# EAGLE design board (EAGLE 8.7.1)
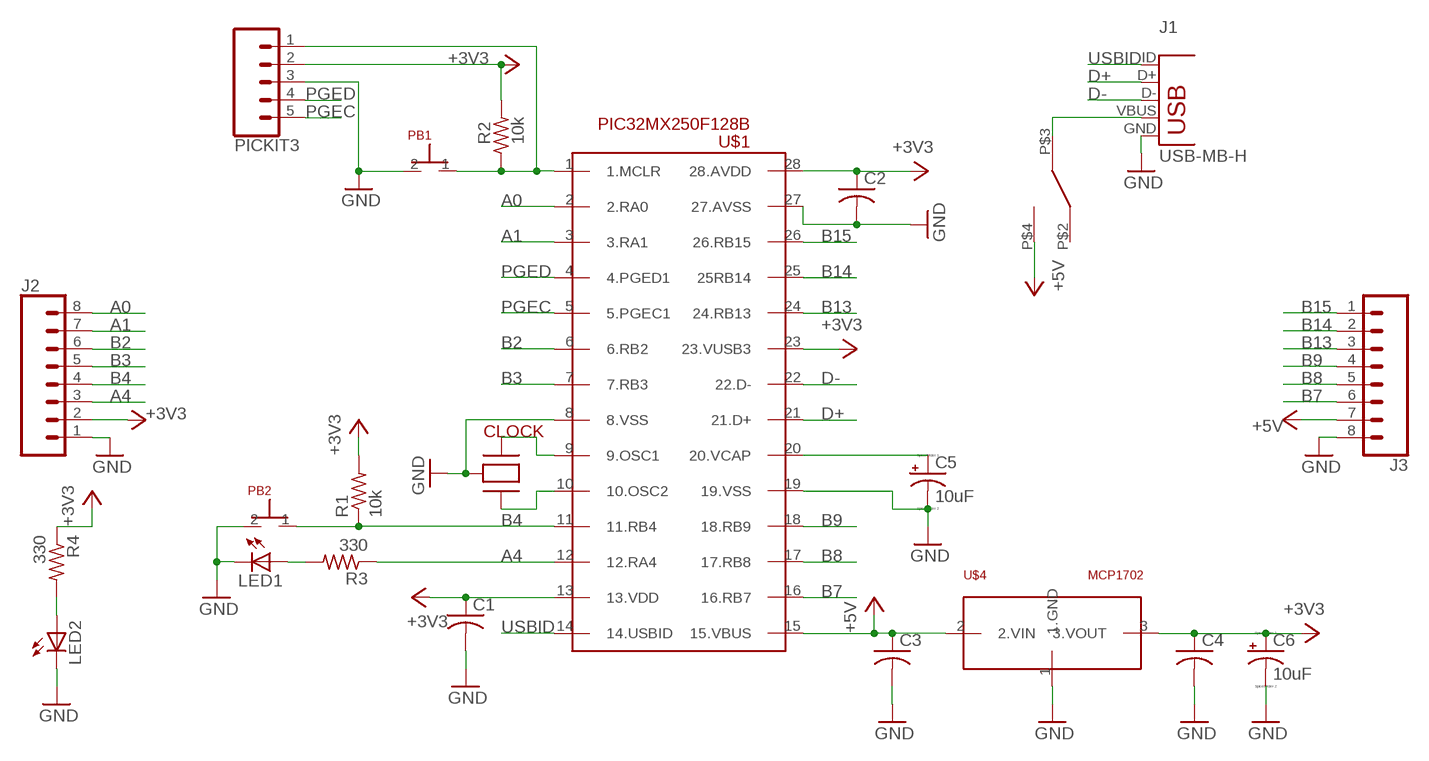
[diagram p0: schematic, sheet 1]

## Parts
C1  C-US025-024X044  [C025-024X044]
C2  C-US025-024X044  [C025-024X044]
C3  C-US025-024X044  [C025-024X044]
C4  C-US025-024X044  [C025-024X044]
C5  10uF  CPOL-USB45181A  [B45181A]
C6  10uF  CPOL-USB45181A  [B45181A]
CLOCK  CLOCK  [CLOCK]
J1  USB-MB-H  [USB-MB-H]
J2  CONN_08"  [1X08]
J3  CONN_08"  [1X08]
LED1  LED3MM  [LED3MM]
LED2  LED3MM  [LED3MM]
PB1  PBUTTON  [PBUTTON]
PB2  PBUTTON  [PBUTTON]
PICKIT3  CONN_05  [1X05]
R1  10k  R-US_0204/7  [0204/7]
R2  10k  R-US_0204/7  [0204/7]
R3  330  R-US_0204/7  [0204/7]
R4  330  R-US_0204/7  [0204/7]
U$1  PIC32MX250F128B  [DIL28-3]
U$2  SWITCH  [SWITCH]
U$4  MCP1702  [TO92]

## Nets
+3V3: C1.1 C2.1 C4.1 C6.+ J2.2 PICKIT3.2 R1.2 R2.2 R4.1 U$1.13(13.VDD) U$1.23(23.VUSB3) U$1.28(28.AVDD) U$4.3(3.VOUT)
+5V: C3.1 J3.7 U$1.15(15.VBUS) U$2.P$4(4.OUT2) U$4.2(2.VIN)
A0: J2.8 U$1.2(2.RA0)
A1: J2.7 U$1.3(3.RA1)
A4: J2.3 R3.1 U$1.12(12.RA4)
B2: J2.6 U$1.6(6.RB2)
B3: J2.5 U$1.7(7.RB3)
B4: J2.4 PB2.1(PIN1) R1.1 U$1.11(11.RB4)
B7: J3.6 U$1.16(16.RB7)
B8: J3.5 U$1.17(17.RB8)
B9: J3.4 U$1.18(18.RB9)
B13: J3.3 U$1.24(24.RB13)
B14: J3.2 U$1.25(25RB14)
B15: J3.1 U$1.26(26.RB15)
D+: J1.D+ U$1.21(21.D+)
D-: J1.D- U$1.22(22.D-)
GND: C1.2 C2.2 C3.2 C4.2 C5.- C6.- CLOCK.2(2.GND) J1.GND J2.1 J3.8 LED1.K(C) LED2.K(C) PB1.2(PIN2) PB2.2(PIN2) PICKIT3.3 U$1.8(8.VSS) U$1.19(19.VSS) U$1.27(27.AVSS) U$4.1(1.GND)
N$1: PB1.1(PIN1) PICKIT3.1 R2.1 U$1.1(1.MCLR)
N$4: J1.VBUS U$2.P$3(3.IN)
N$9: C5.+ U$1.20(20.VCAP)
N$10: CLOCK.1(1.OSC1) U$1.9(9.OSC1)
N$11: CLOCK.3(3.OSC2) U$1.10(10.OSC2)
N$13: LED1.A R3.2
N$16: LED2.A R4.2
PGEC: PICKIT3.5 U$1.5(5.PGEC1)
PGED: PICKIT3.4 U$1.4(4.PGED1)
USBID: J1.ID U$1.14(14.USBID)
Unconnected: U$2.P$2(2.OUT1)

## Library data of the parts
C1-C4 = lib1:C-US: CAPACITOR, American symbol
C5 C6 = lib1:CPOL-US: POLARIZED CAPACITOR, American symbol
CLOCK = lib1:CLOCK
J1 = lib1:USB: USB Connectors USB-B-PTH is fully proven SKU : PRT-00139/CONN-08278 USB-miniB is fully proven SKU : PRT-00587 USB-A-PCB is untested. USB-A-H is throughly reviewed, but untested. Spark Fun Electronics SKU : PRT-00437 USB-B-SMT is throughly reviewed, but untested. Needs silkscreen touching up. USB-A-S has not been used/tested USB-MB-H has not been used/tested USB-MICROB has been used. CONN-09505
J2 J3 = lib1:CONN_08: Multi connection point. Often used as Generic Header-pin footprint for 0.1 inch spaced/style header connections On any of the 0.1 inch spaced packages, you can populate with these: Break Away Headers - Straight <https://www.sparkfun.com/products/116> (PRT-00116) Break Away Male Headers - Right Angle <https://www.sparkfun.com/products/553> (PRT-00553) Female Headers <https://www.sparkfun.com/products/115> (PRT-00115) Break Away Headers - Machine Pin <https://www.sparkfun.com/products/117> (PRT-00117) Break Away Female Headers - Swiss Machine Pin <https://www.sparkfun.com/products/743> (PRT-00743) Arduino Stackable Header - 8 Pin <https://www.sparkfun.com/products/9279> (PRT-09279) For SCREWTERMINALS and SPRING TERMINALS visit here: Screw Terimnals on SparkFun.com <https://www.sparkfun.com/search/results?term=Screw+Terminals> (5mm/3.5mm/2.54mm spacing) This device is also useful as a general connection point to wire up your design to another part of your project. Our various solder wires solder well into these plated through hole pads. Hook-Up Wire - Assortment (Stranded, 22 AWG) <https://www.sparkfun.com/products/11375> (PRT-11375) Hook-Up Wire - Assortment (Solid Core, 22 AWG) <https://www.sparkfun.com/products/11367> (PRT-11367) View the entire wire category on our website here <https://www.sparkfun.com/categories/141> Special notes: Molex polarized connector foot print use with SKU : PRT-08231 with associated crimp pins and housings. 1MM SMD Version SKU: PRT-10208 NOTES ON THE VARIANTS LOCK and LOCK_LONGPADS... This footprint was designed to help hold the alignment of a through-hole component (i.e. 6-pin header) while soldering it into place. You may notice that each hole has been shifted either up or down by 0.005 of an inch from it's more standard position (which is a perfectly straight line). This slight alteration caused the pins (the squares in the middle) to touch the edges of the holes. Because they are alternating, it causes a "brace" to hold the component in place. 0.005 has proven to be the perfect amount of "off-center" position when using our standard breakaway headers. Although looks a little odd when you look at the bare footprint, once you have a header in there, the alteration is very hard to notice. Also,if you push a header all the way into place, it is covered up entirely on the bottom side.; PROD_ID: CONN-08438
LED1 LED2 = lib1:LED: LED OSRAM: - CHIPLED LG R971, LG N971, LY N971, LG Q971, LY Q971, LO R971, LY R971 LH N974, LH R974 LS Q976, LO Q976, LY Q976 LO Q996 - Hyper CHIPLED LW Q18S LB Q993, LB Q99A, LB R99A - SideLED LS A670, LO A670, LY A670, LG A670, LP A670 LB A673, LV A673, LT A673, LW A673 LH A674 LY A675 LS A676, LA A676, LO A676, LY A676, LW A676 LS A679, LY A679, LG A679 - Hyper Micro SIDELED® LS Y876, LA Y876, LO Y876, LY Y876 LT Y87S - SmartLED LW L88C, LW L88S LB L89C, LB L89S, LG L890 LS L89K, LO L89K, LY L89K LS L896, LA L896, LO L896, LY L896 - TOPLED LS T670, LO T670, LY T670, LG T670, LP T670 LSG T670, LSP T670, LSY T670, LOP T670, LYG T670 LG T671, LOG T671, LSG T671 LB T673, LV T673, LT T673, LW T673 LH T674 LS T676, LA T676, LO T676, LY T676, LB T676, LH T676, LSB T676, LW T676 LB T67C, LV T67C, LT T67C, LS T67K, LO T67K, LY T67K, LW E67C LS E67B, LA E67B, LO E67B, LY E67B, LB E67C, LV E67C, LT E67C LW T67C LS T679, LY T679, LG T679 LS T770, LO T770, LY T770, LG T770, LP T770 LB T773, LV T773, LT T773, LW T773 LH T774 LS E675, LA E675, LY E675, LS T675 LS T776, LA T776, LO T776, LY T776, LB T776 LHGB T686 LT T68C, LB T68C - Hyper Mini TOPLED® LB M676 - Mini TOPLED Santana® LG M470 LS M47K, LO M47K, LY M47K Source: http://www.osram.convergy.de LUXEON: - LUMILED® LXK2-PW12-R00, LXK2-PW12-S00, LXK2-PW14-U00, LXK2-PW14-V00 LXK2-PM12-R00, LXK2-PM12-S00, LXK2-PM14-U00 LXK2-PE12-Q00, LXK2-PE12-R00, LXK2-PE12-S00, LXK2-PE14-T00, LXK2-PE14-U00 LXK2-PB12-K00, LXK2-PB12-L00, LXK2-PB12-M00, LXK2-PB14-N00, LXK2-PB14-P00, LXK2-PB14-Q00 LXK2-PR12-L00, LXK2-PR12-M00, LXK2-PR14-Q00, LXK2-PR14-R00 LXK2-PD12-Q00, LXK2-PD12-R00, LXK2-PD12-S00 LXK2-PH12-R00, LXK2-PH12-S00 LXK2-PL12-P00, LXK2-PL12-Q00, LXK2-PL12-R00 Source: www.luxeon.com KINGBRIGHT: KA-3528ASYC Source: www.kingbright.com
PB1 PB2 = lib1:PBUTTON
PICKIT3 = lib1:CONN_05: Multi connection point. Often used as Generic Header-pin footprint for 0.1 inch spaced/style header connections On any of the 0.1 inch spaced packages, you can populate with these: Break Away Headers - Straight <https://www.sparkfun.com/products/116> (PRT-00116) Break Away Male Headers - Right Angle <https://www.sparkfun.com/products/553> (PRT-00553) Female Headers <https://www.sparkfun.com/products/115> (PRT-00115) Break Away Headers - Machine Pin <https://www.sparkfun.com/products/117> (PRT-00117) Break Away Female Headers - Swiss Machine Pin <https://www.sparkfun.com/products/743> (PRT-00743) For SCREWTERMINALS and SPRING TERMINALS visit here: Screw Terimnals on SparkFun.com <https://www.sparkfun.com/search/results?term=Screw+Terminals> (5mm/3.5mm/2.54mm spacing) This device is also useful as a general connection point to wire up your design to another part of your project. Our various solder wires solder well into these plated through hole pads. Hook-Up Wire - Assortment (Stranded, 22 AWG) <https://www.sparkfun.com/products/11375> (PRT-11375) Hook-Up Wire - Assortment (Solid Core, 22 AWG) <https://www.sparkfun.com/products/11367> (PRT-11367) View the entire wire category on our website here <https://www.sparkfun.com/categories/141> Special notes: Molex polarized connector foot print use with SKU : PRT-08231 with associated crimp pins and housings. 1MM SMD Version SKU: PRT-10208
R1-R4 = lib1:R-US_: RESISTOR, American symbol
U$1 = lib1:PIC32MX250F128B
U$2 = lib1:SWITCH
U$4 = lib1:MCP1702

## Board
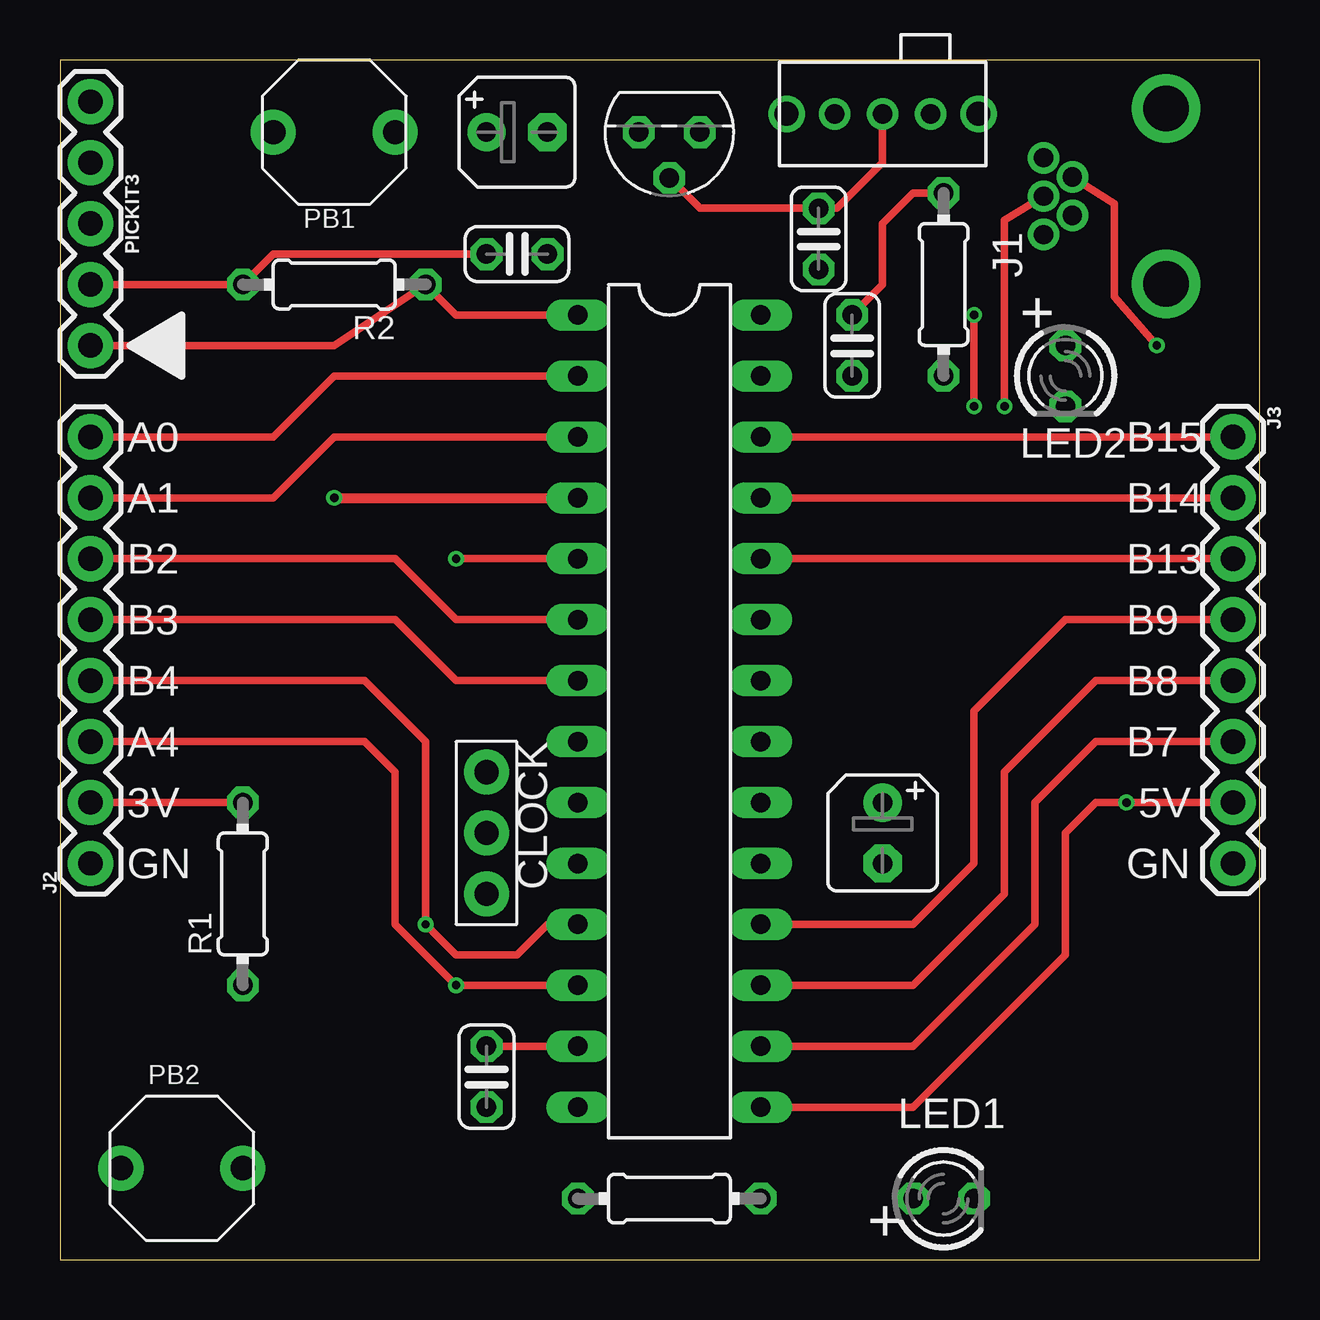
[diagram p1: board, top side]
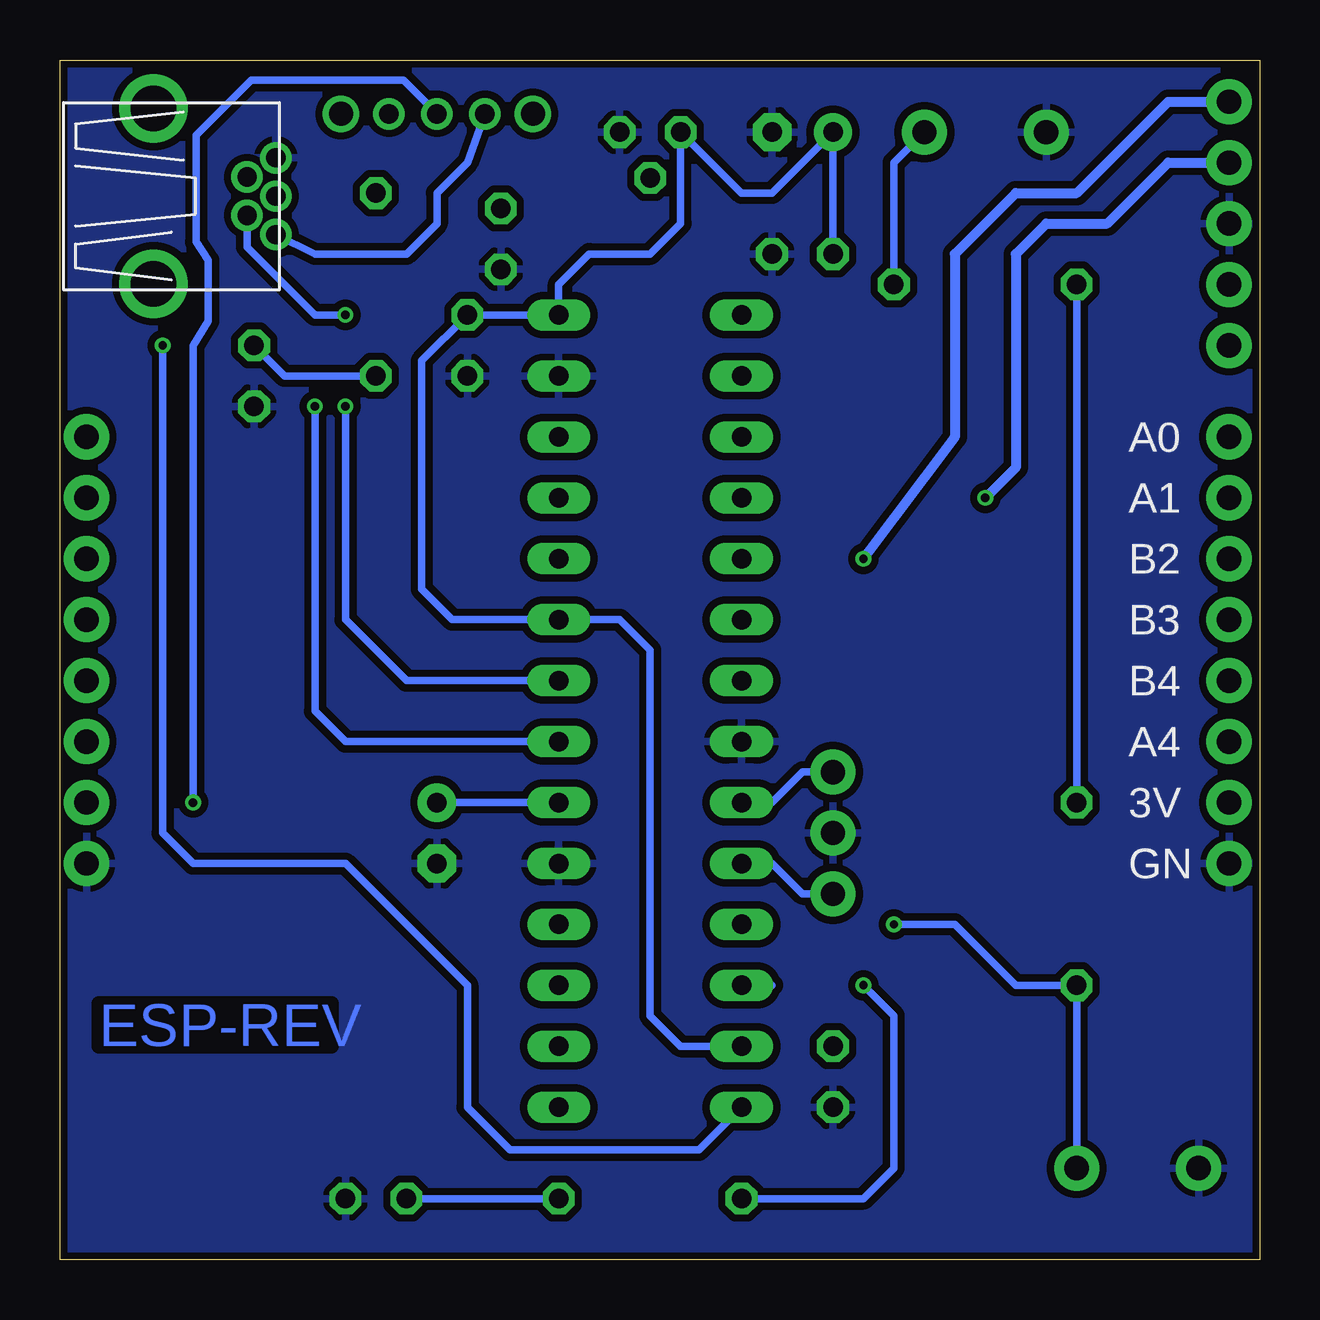
[diagram p2: board, bottom side, seen from below]

Size 50 x 50 mm. Coordinates in mm from the lower left corner, seen from the top.
Outline: 0,0 50,0 50,50 0,50 0,0
Copper layers (1*16): Top 0.035mm / dielectric 1.5mm / Bottom 0.035mm
Design rules "SeeedStudio_2layer_DRU_no_angle_20140221": minimum track width 6mil, minimum drill 12mil, track to track 6mil, track to pad 6mil, pad to pad 6mil, via to via 6mil, smd to smd 0mil, copper to edge 10mil, drill to drill 10mil, minimum pad ring 10mil, minimum via ring 6mil, stop-mask expansion 2mil, vias tented up to drill 100mil, thermal gap 10mil

### Footprints (pad centres in the part's own frame; a part is rotated, then mirrored left to right if it is on the bottom)
C025-024X044 = drill 0.813 octagon: 1 -1.27,0; 2 1.27,0
B45181A = drill 0.813 pad 1.6: + -1.27,0 | drill 0.813 pad 1.6 octagon: - 1.27,0
CLOCK = drill 1.016 pad 1.88: 1 -2.54,0; 2 0,0; 3 2.54,0
USB-MB-H = drill 0.8: D+ 5.1,0; D- 3.9,0.8; GND 5.1,-1.6; ID 3.9,-0.8; VBUS 5.1,1.6 | drill 1.9: P$6 0,-3.65; P$7 0,3.65
1X08 = drill 1.016 pad 1.88: 1 0,0; 2 2.54,0; 3 5.08,0; 4 7.62,0; 5 10.16,0; 6 12.7,0; 7 15.24,0; 8 17.78,0
LED3MM = drill 0.813 octagon: A -1.27,0; K 1.27,0
PBUTTON = drill 1.016 pad 1.88: 1 -2.54,0; 2 2.54,0
1X05 = drill 1.016 pad 1.88: 1 0,0; 2 2.54,0; 3 5.08,0; 4 7.62,0; 5 10.16,0
0204/7 = drill 0.813 octagon: 1 -3.81,0; 2 3.81,0
DIL28-3 = drill 0.813 long: 1 -16.51,-3.81; 2 -13.97,-3.81; 3 -11.43,-3.81; 4 -8.89,-3.81; 5 -6.35,-3.81; 6 -3.81,-3.81; 7 -1.27,-3.81; 8 1.27,-3.81; 9 3.81,-3.81; 10 6.35,-3.81; 11 8.89,-3.81; 12 11.43,-3.81; 13 13.97,-3.81; 14 16.51,-3.81; 15 16.51,3.81; 16 13.97,3.81; 17 11.43,3.81; 18 8.89,3.81; 19 6.35,3.81; 20 3.81,3.81; 21 1.27,3.81; 22 -1.27,3.81; 23 -3.81,3.81; 24 -6.35,3.81; 25 -8.89,3.81; 26 -11.43,3.81; 27 -13.97,3.81; 28 -16.51,3.81
SWITCH = drill 1: P$1 4,0; P$2 -4,0 | drill 0.8: P$3 -2,0; P$4 0,0; P$5 2,0
TO92 = drill 0.813 octagon: 1 -1.27,0; 2 0,1.905; 3 1.27,0

### Placement (x,y rotation side)
C1  19.05,41.91 0 top
C2  33.02,38.1 270 top
C3  31.62,42.55 270 top
C4  17.78,7.62 270 top
C5  34.29,17.78 270 top
C6  19.05,46.99 0 top
CLOCK  17.78,17.78 270 top
J1  46.1,44.32 180 top
J2  1.27,16.51 90 top
J3  48.9,34.29 270 top
LED1  36.83,2.54 0 top
LED2  41.91,36.83 270 top
PB1  11.43,46.99 180 top
PB2  5.08,3.81 180 top
PICKIT3  1.27,38.1 90 top
R1  7.62,15.24 90 top
R2  11.43,40.64 180 top
R3  25.4,2.54 0 top
R4  36.83,40.64 270 top
U$1  25.4,22.86 270 top
U$2  34.29,47.75 0 top
U$4  25.4,46.99 180 top

### Tracks (layer width: path | path; a pad name or v marks a point on that pad's centre or on a via)
+3V3
  Top 0.305: U$1.13 C4.1 | C1.1 8.89,41.91 R2.2 PICKIT3.2 | C2.1 34.29,40.64 34.29,43.18 35.56,44.45 R4.1 | J2.2 R1.2
  Bottom 0.305: C1.1 C6.+ 20.32,44.45 21.59,44.45 U$4.3 24.13,43.18 25.4,41.91 27.94,41.91 29.21,40.64 U$1.28 C2.1 34.92,37.47 34.92,27.94 33.66,26.67 U$1.23 26.67,26.67 25.4,25.4 25.4,10.16 24.13,8.89 U$1.13 | R2.2 R1.2
+5V  (via drill 0.35)
  Top 0.305: U$1.15 35.56,6.35 41.91,12.7 41.91,17.78 43.18,19.05 v44.45,19.05 J3.7 | U$4.2 26.67,43.81 C3.1 32.38,43.81 34.29,45.72 U$2.P$4
  Bottom 0.305: 44.45,38.1 43.81,39.12 43.81,41.66 44.32,42.42 44.32,46.86 42.04,49.15 35.69,49.15 U$2.P$4 | 44.45,38.1 v44.45,19.05 44.45,38.1
A0
  Top 0.305: U$1.2 11.43,36.83 8.89,34.29 J2.8
A1
  Top 0.305: U$1.3 11.43,34.29 8.89,31.75 J2.7
A4  (via drill 0.35)
  Top 0.305: U$1.12 v16.51,11.43 13.97,13.97 13.97,20.32 12.7,21.59 J2.3
  Bottom 0.305: U$1.12 20.32,11.43 | R3.1 16.51,2.54 15.24,3.81 15.24,10.16 v16.51,11.43
B2
  Top 0.305: U$1.6 16.51,26.67 13.97,29.21 J2.6
B3
  Top 0.305: U$1.7 16.51,24.13 13.97,26.67 J2.5
B4  (via drill 0.35)
  Top 0.305: J2.4 12.7,24.13 15.24,21.59 v15.24,13.97 16.51,12.7 19.05,12.7 20.32,13.97 U$1.11
  Bottom 0.305: v15.24,13.97 12.7,13.97 10.16,11.43 R1.1 PB2.1
B7
  Top 0.305: U$1.16 35.56,8.89 40.64,13.97 40.64,19.05 43.18,21.59 J3.6
B8
  Top 0.305: U$1.17 35.56,11.43 39.37,15.24 39.37,20.32 43.18,24.13 J3.5
B9
  Top 0.305: U$1.18 35.56,13.97 38.1,16.51 38.1,22.86 41.91,26.67 J3.4
B13
  Top 0.305: J3.3 U$1.24
B14
  Top 0.305: J3.2 U$1.25
B15
  Top 0.305: J3.1 U$1.26
D+  (via drill 0.35)
  Top 0.305: J1.D+ 39.37,43.33 v39.37,35.56
  Bottom 0.305: v39.37,35.56 39.37,22.86 38.1,21.59 U$1.21
D-  (via drill 0.35)
  Top 0.305: v38.1,39.37 v38.1,35.56
  Bottom 0.305: J1.D- 42.2,42.2 39.37,39.37 v38.1,39.37 | v38.1,35.56 38.1,26.67 35.56,24.13 U$1.22
GND
  pour Bottom (isolate 0.305): -1.27,50.8 -1.27,-1.27 52.07,-1.27 52.07,50.8
N$1
  Top 0.305: U$1.1 16.51,39.37 R2.1 11.43,38.1 PICKIT3.1
  Bottom 0.305: R2.1 15.24,45.72 PB1.1
N$4
  Bottom 0.305: J1.VBUS 39.37,41.91 35.56,41.91 34.29,43.18 34.29,44.45 33.02,45.72 U$2.P$3
N$9
  Bottom 0.305: U$1.20 C5.+
N$10
  Bottom 0.305: U$1.9 20.32,19.05 19.05,20.32 CLOCK.1
N$11
  Bottom 0.305: U$1.10 20.32,16.51 19.05,15.24 CLOCK.3
N$13
  Bottom 0.305: LED1.A R3.2
N$16
  Bottom 0.305: LED2.A 40.64,36.83 R4.2
PGEC  (via drill 0.35)
  Top 0.305: v16.51,29.21 U$1.5
  Bottom 0.406: v16.51,29.21 12.7,34.29 12.7,41.91 10.16,44.45 7.62,44.45 3.81,48.26 PICKIT3.5
PGED  (via drill 0.35)
  Top 0.406: v11.43,31.75 U$1.4
  Bottom 0.406: v11.43,31.75 10.16,33.02 10.16,41.91 8.89,43.18 6.35,43.18 3.81,45.72 PICKIT3.4
USBID  (via drill 0.35)
  Top 0.305: J1.ID 43.94,44.02 43.94,40.13 v45.72,38.1
  Bottom 0.305: v45.72,38.1 45.72,17.78 44.45,16.51 38.1,16.51 33.02,11.43 33.02,6.35 31.24,4.57 23.37,4.57 U$1.14

### Text on the board
Bottom: ESP-REV
tPlace: + | A0 | B15 | B15 | A1 | B14 | B2 | B13 | B3 | B9 | B4 | B8 | A4 | B7 | 3V | 5V | GN | GN | +
bPlace: A0 | A1 | B2 | B3 | B4 | A4 | 3V | GN